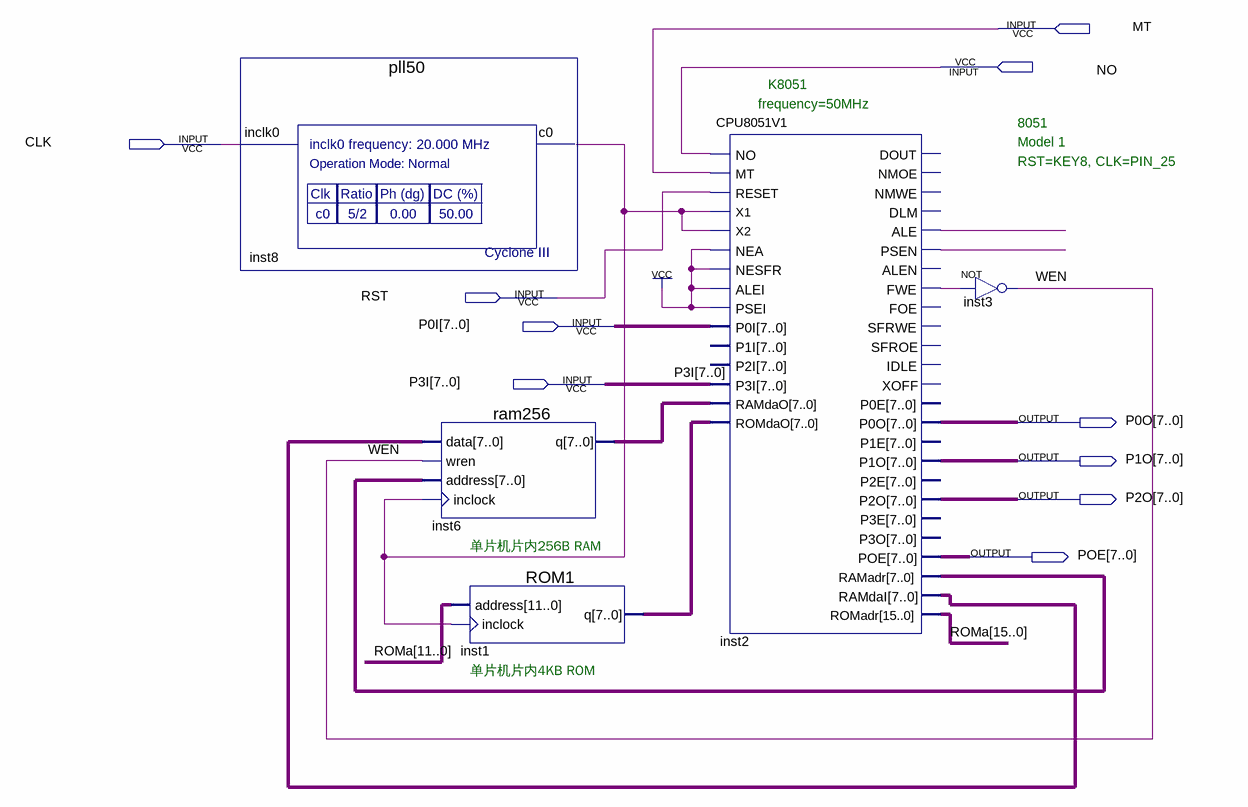
[diagram p0: schematic sheet]
// Quartus schematic MCU8951.bdf as structural Verilog: 5 symbols, 10 pins
module MCU8951 (
  input  MT,
  input  NO,
  input  CLK,
  input  RST,
  input  [7:0] P0I,
  input  [7:0] P3I,
  output [7:0] P0O,
  output [7:0] P1O,
  output [7:0] P2O,
  output [7:0] POE
);

  wire inst2_ale, inst2_fwe, inst2_psen, inst8_c0, WEN;
  wire [7:0] inst1_q, inst2_ramadr, inst2_ramdai, inst6_q;
  wire [15:0] ROMa;

  pll50 inst8 (.inclk0(CLK), .c0(inst8_c0));
  ram256 inst6 (.data(inst2_ramdai), .wren(WEN), .address(inst2_ramadr), .inclock(inst8_c0), .q(inst6_q));
  ROM1 inst1 (.address(ROMa[11:0]), .inclock(inst8_c0), .q(inst1_q));
  CPU8051V1 inst2 (
    .NO(NO), .MT(MT), .RESET(RST), .X1(inst8_c0), .X2(inst8_c0), .NEA(1'b1), .NESFR(1'b1), .ALEI(1'b1),
    .PSEI(1'b1), .P0I(P0I), .P3I(P3I), .RAMdaO(inst6_q), .ROMdaO(inst1_q), .ALE(inst2_ale),
    .PSEN(inst2_psen), .FWE(inst2_fwe), .P0O(P0O), .P1O(P1O), .P2O(P2O), .POE(POE), .RAMadr(inst2_ramadr),
    .RAMdaI(inst2_ramdai), .ROMadr(ROMa));  // open: P1I, P2I, DOUT, NMOE, NMWE, DLM, ALEN, FOE, SFRWE, SFROE, IDLE, XOFF, P0E, P1E, P2E, P3E, P3O
  not inst3 (WEN, inst2_fwe);

  // Notes on the sheet:
  //   K8051
  //   frequency=50MHz
  //   8051
  //   Model 1
  //   RST=KEY8, CLK=PIN_25   
  //   单片机片内256B RAM
  //   单片机片内4KB ROM
endmodule
